# EAGLE design MYO power distribution pcb (EAGLE 6.1)
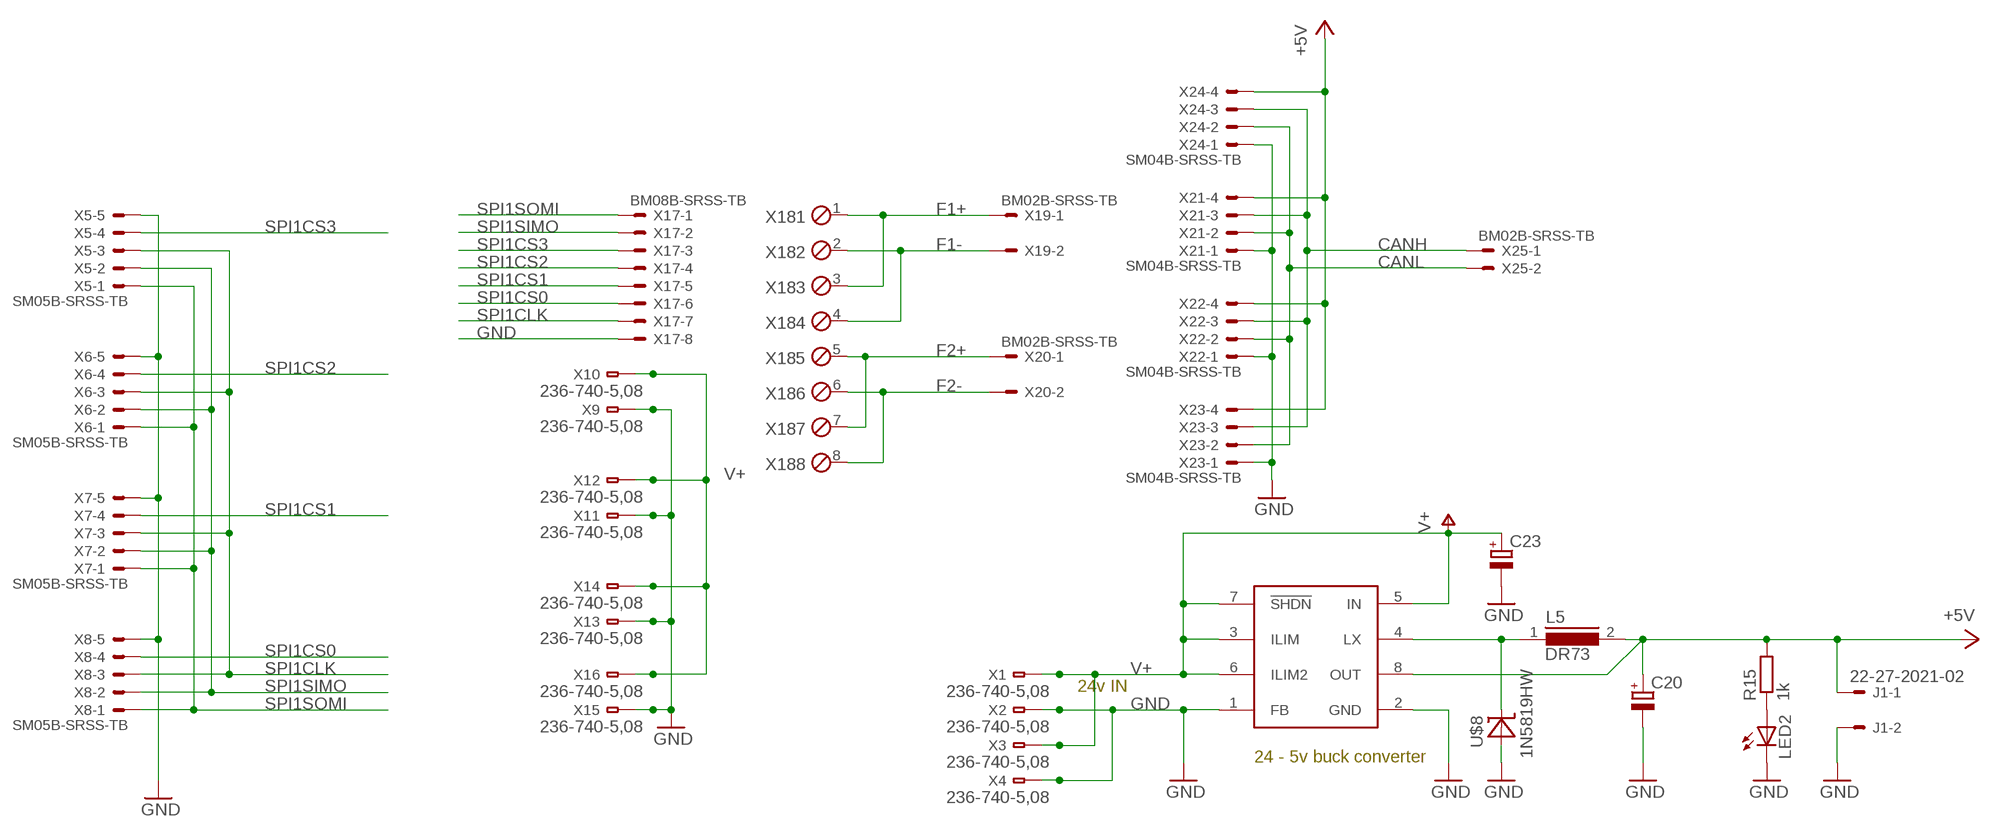
[diagram p0: schematic, sheet 1]

## Parts
C20  CPOL-EUC/6032-28R  [C/6032-28R]
C23  CPOL-EUC/6032-28R  [C/6032-28R]
J1  22-27-2021-02  [6410-02]
L5  DR73  [DR73]
LED2  LEDCHIP-LED0805  [CHIP-LED0805]
R15  1k  R-EU_R0603  [R0603]
U$5  MAX1776  [UMAX8]
U$8  1N5819HW  [SOD123]
X1  236-740-5,08  [236-4XX]
X2  236-740-5,08  [236-4XX]
X3  236-740-5,08  [236-4XX]
X4  236-740-5,08  [236-4XX]
X5  SM05B-SRSS-TB  [SM05B-SRSS-TB]
X6  SM05B-SRSS-TB  [SM05B-SRSS-TB]
X7  SM05B-SRSS-TB  [SM05B-SRSS-TB]
X8  SM05B-SRSS-TB  [SM05B-SRSS-TB]
X9  236-740-5,08  [236-4XX]
X10  236-740-5,08  [236-4XX]
X11  236-740-5,08  [236-4XX]
X12  236-740-5,08  [236-4XX]
X13  236-740-5,08  [236-4XX]
X14  236-740-5,08  [236-4XX]
X15  236-740-5,08  [236-4XX]
X16  236-740-5,08  [236-4XX]
X17  BM08B-SRSS-TB  [BM08B-SRSS-TB]
X18  CON_PTSA_8  [PHOENIX_PSTA_8]
X19  BM02B-SRSS-TB  [BM02B-SRSS-TB]
X20  BM02B-SRSS-TB  [BM02B-SRSS-TB]
X21  SM04B-SRSS-TB  [SM04B-SRSS-TB]
X22  SM04B-SRSS-TB  [SM04B-SRSS-TB]
X23  SM04B-SRSS-TB  [SM04B-SRSS-TB]
X24  SM04B-SRSS-TB  [SM04B-SRSS-TB]
X25  BM02B-SRSS-TB  [BM02B-SRSS-TB]

## Nets
+5V: C20.+ J1.1 L5.2 R15.2 U$5.8(OUT) X21.4 X22.4 X23.4 X24.4
CANH: X21.3 X22.3 X23.3 X24.3 X25.1
CANL: X21.2 X22.2 X23.2 X24.2 X25.2
F1+: X18.1 X18.3 X19.1
F1-: X18.2 X18.4 X19.2
F2+: X18.5 X18.7 X20.1
F2-: X18.6 X18.8 X20.2
GND: C20.- C23.- J1.2 LED2.C U$5.1(FB) U$5.2(GND) U$8.A X2.1@1(A1) X2.1@2(B1) X4.1@1(A1) X4.1@2(B1) X5.5 X6.5 X7.5 X8.5 X9.1@1(A1) X9.1@2(B1) X11.1@1(A1) X11.1@2(B1) X13.1@1(A1) X13.1@2(B1) X15.1@1(A1) X15.1@2(B1) X17.8 X21.1 X22.1 X23.1 X24.1
N$9: LED2.A R15.1
N$30: L5.1 U$5.4(LX) U$8.C
SPI1CLK: X5.3 X6.3 X7.3 X8.3 X17.7
SPI1CS0: X8.4 X17.6
SPI1CS1: X7.4 X17.5
SPI1CS2: X6.4 X17.4
SPI1CS3: X5.4 X17.3
SPI1SIMO: X5.2 X6.2 X7.2 X8.2 X17.2
SPI1SOMI: X5.1 X6.1 X7.1 X8.1 X17.1
V+: C23.+ U$5.3(ILIM) U$5.5(IN) U$5.6(ILIM2) U$5.7(!SHDN) X1.1@1(A1) X1.1@2(B1) X3.1@1(A1) X3.1@2(B1) X10.1@1(A1) X10.1@2(B1) X12.1@1(A1) X12.1@2(B1) X14.1@1(A1) X14.1@2(B1) X16.1@1(A1) X16.1@2(B1)

## Notes on the sheet
- 24v IN
- 24 - 5v buck converter

## Library data of the parts
C20 C23 = rcl:CPOL-EU: POLARIZED CAPACITOR, European symbol
J1 = con-molex:22-?-02: CONNECTOR wire to board 2.54 mm (.1 inch) pitch header; OC_FARNELL: unknown; OC_NEWARK: unknown
L5 = inductors:DR73: High Power Density, High Efficiency, Shielded Inductors Source: coiltronics_dr_series.pdf
LED2 = led:LED: LED OSRAM: - CHIPLED LG R971, LG N971, LY N971, LG Q971, LY Q971, LO R971, LY R971 LH N974, LH R974 LS Q976, LO Q976, LY Q976 LO Q996 - Hyper CHIPLED LW Q18S LB Q993, LB Q99A, LB R99A - SideLED LS A670, LO A670, LY A670, LG A670, LP A670 LB A673, LV A673, LT A673, LW A673 LH A674 LY A675 LS A676, LA A676, LO A676, LY A676, LW A676 LS A679, LY A679, LG A679 - Hyper Micro SIDELED® LS Y876, LA Y876, LO Y876, LY Y876 LT Y87S - SmartLED LW L88C, LW L88S LB L89C, LB L89S, LG L890 LS L89K, LO L89K, LY L89K LS L896, LA L896, LO L896, LY L896 - TOPLED LS T670, LO T670, LY T670, LG T670, LP T670 LSG T670, LSP T670, LSY T670, LOP T670, LYG T670 LG T671, LOG T671, LSG T671 LB T673, LV T673, LT T673, LW T673 LH T674 LS T676, LA T676, LO T676, LY T676, LB T676, LH T676, LSB T676, LW T676 LB T67C, LV T67C, LT T67C, LS T67K, LO T67K, LY T67K, LW E67C LS E67B, LA E67B, LO E67B, LY E67B, LB E67C, LV E67C, LT E67C LW T67C LS T679, LY T679, LG T679 LS T770, LO T770, LY T770, LG T770, LP T770 LB T773, LV T773, LT T773, LW T773 LH T774 LS E675, LA E675, LY E675, LS T675 LS T776, LA T776, LO T776, LY T776, LB T776 LHGB T686 LT T68C, LB T68C - Hyper Mini TOPLED® LB M676 - Mini TOPLED Santana® LG M470 LS M47K, LO M47K, LY M47K Source: http://www.osram.convergy.de LUXEON: - LUMILED® LXK2-PW12-R00, LXK2-PW12-S00, LXK2-PW14-U00, LXK2-PW14-V00 LXK2-PM12-R00, LXK2-PM12-S00, LXK2-PM14-U00 LXK2-PE12-Q00, LXK2-PE12-R00, LXK2-PE12-S00, LXK2-PE14-T00, LXK2-PE14-U00 LXK2-PB12-K00, LXK2-PB12-L00, LXK2-PB12-M00, LXK2-PB14-N00, LXK2-PB14-P00, LXK2-PB14-Q00 LXK2-PR12-L00, LXK2-PR12-M00, LXK2-PR14-Q00, LXK2-PR14-R00 LXK2-PD12-Q00, LXK2-PD12-R00, LXK2-PD12-S00 LXK2-PH12-R00, LXK2-PH12-S00 LXK2-PL12-P00, LXK2-PL12-Q00, LXK2-PL12-R00 Source: www.luxeon.com KINGBRIGHT: KA-3528ASYC Source: www.kingbright.com
R15 = rcl:R-EU_: RESISTOR, European symbol
U$5 = maxim:MAX1776: Step down Switching DC DC converter
U$8 = diode:1N5819HW
X1-X4 X9-X16 = con-wago:236: Anreihbare Einzelklemme 2,5 mm² 16A Rastermaß 5/5,08 | 7,5/7,62 | 10/10,16
X5-X8 = con-jst2:?M05B-SRSS-TB: Disconnectable Crimp style connector, 1.0mm pitch 5 contacts
X17 = con-jst2:?M08B-SRSS-TB: Disconnectable Crimp style connector, 1.0mm pitch 8 contacts
X18 = jas new (2):CON_PTSA_8
X19 X20 X25 = con-jst2:?M02B-SRSS-TB: Disconnectable Crimp style connector, 1.0mm pitch 2 contacts
X21-X24 = con-jst2:?M04B-SRSS-TB: Disconnectable Crimp style connector, 1.0mm pitch 4 contacts

## Board
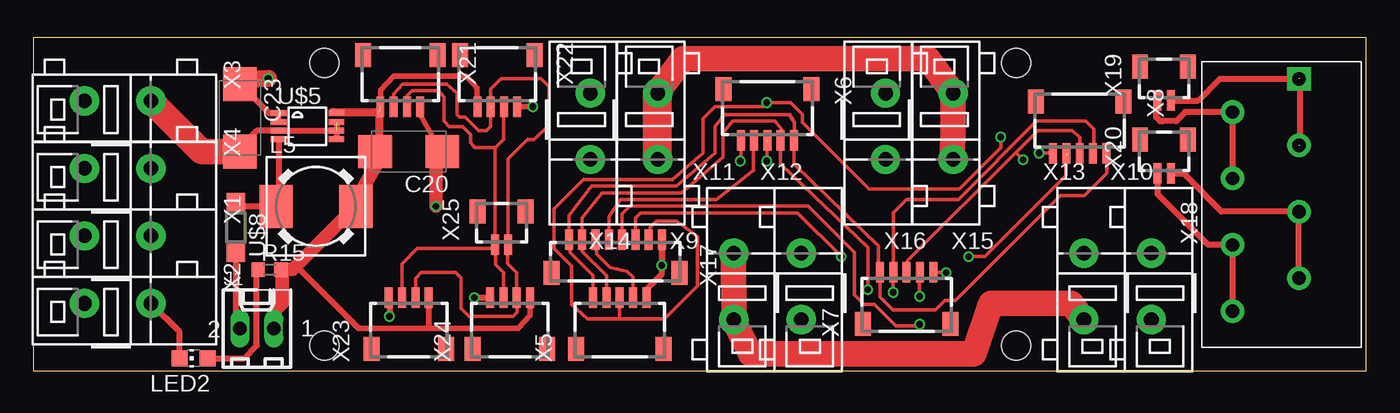
[diagram p1: board, top side]
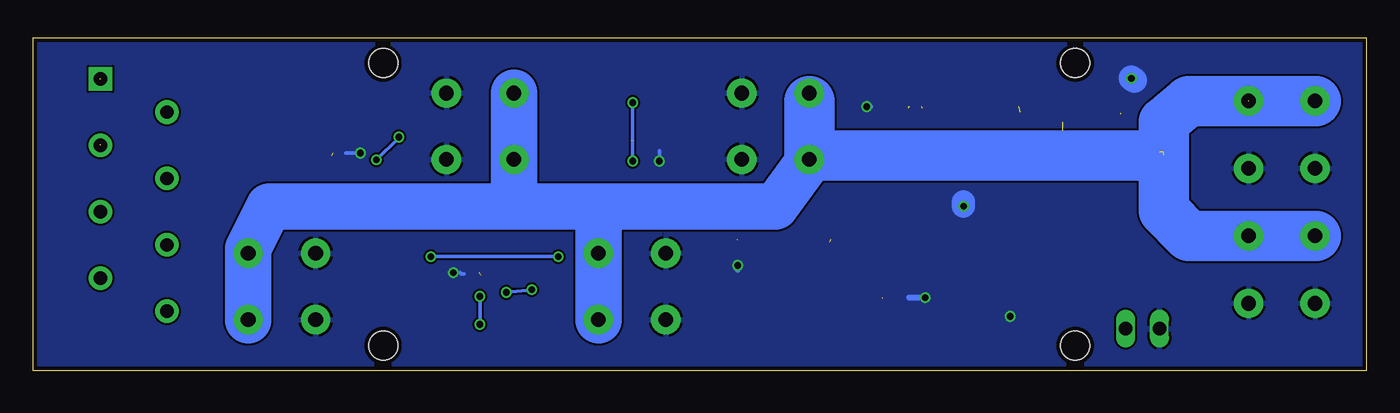
[diagram p2: board, bottom side, seen from below]

Size 100.31 x 25.07 mm. Coordinates in mm from the lower left corner, seen from the top.
Outline: 0,0 100.31,0 100.31,25.07 0,25.07 0,0
Copper layers (1*16): Top 0.035mm / dielectric 1.5mm / Bottom 0.035mm
Design rules: minimum track width 0.15mm, minimum drill 0.3mm, track to track 0.15mm, track to pad 0.15mm, pad to pad 0.15mm, via to via 0.15mm, smd to smd 0.15mm, copper to edge 0.3mm, drill to drill 0.2mm, minimum pad ring 0.2mm, minimum via ring 0.15mm, stop-mask expansion 0.075mm, vias tented up to drill 0mil, thermal gap 0.2mm
Holes 2.2 mm at 21.91,23.18 73.98,23.18 21.91,1.91 73.98,1.91

### Footprints (pad centres in the part's own frame; a part is rotated, then mirrored left to right if it is on the bottom)
C/6032-28R = smd 2.55 x 2.5: + 2.525,0; - -2.525,0
6410-02 = drill 1.016 long: 1 1.27,0; 2 -1.27,0
DR73 = smd 2.5 x 3.25: 1 -3,0; 2 3,0
CHIP-LED0805 = smd 1.2 x 1.2: A 0,-1.05; C 0,1.05
R0603 = smd 1 x 1.1: 1 -0.85,0; 2 0.85,0
UMAX8 = smd 0.45 x 1.2: 1 -0.975,-2.175; 2 -0.325,-2.175; 3 0.325,-2.175; 4 0.975,-2.175; 5 0.975,2.175; 6 0.325,2.175; 7 -0.325,2.175; 8 -0.975,2.175
SOD123 = smd 1.4 x 1.4: A 1.9,0; C -1.9,0
236-4XX = drill 1.1 pad 2.2: 1@1 0,-2.5; 1@2 0,2.5
SM05B-SRSS-TB = smd 0.6 x 1.55: 1 -2,2.975; 2 -1,2.975; 3 0,2.975; 4 1,2.975; 5 2,2.975 | smd 1.2 x 1.8: FIT@1 -3.3,-0.9; FIT@2 3.3,-0.9
BM08B-SRSS-TB = smd 0.6 x 1.55: 1 3.5,-1.625; 2 2.5,-1.625; 3 1.5,-1.625; 4 0.5,-1.625; 5 -0.5,-1.625; 6 -1.5,-1.625; 7 -2.5,-1.625; 8 -3.5,-1.625 | smd 1.2 x 1.8: FIT@1 4.8,0.9; FIT@2 -4.8,0.9
PHOENIX_PSTA_8 = drill 1 pad 1.778 square: 1 15,0 | drill 1 pad 1.778: 2 12.5,5; 3 10,0; 4 7.5,5; 5 5,0; 6 2.5,5; 7 0,0; 8 -2.5,5
BM02B-SRSS-TB = smd 0.6 x 1.55: 1 0.5,-1.625; 2 -0.5,-1.625 | smd 1.2 x 1.8: FIT@1 1.8,0.9; FIT@2 -1.8,0.9
SM04B-SRSS-TB = smd 0.6 x 1.55: 1 -1.5,2.975; 2 -0.5,2.975; 3 0.5,2.975; 4 1.5,2.975 | smd 1.2 x 1.8: FIT@1 -2.8,-0.9; FIT@2 2.8,-0.9

### Placement (x,y rotation side)
C20  28.26,16.51 180 top
C23  15.56,19.05 270 top
J1  16.83,3.17 0 top
L5  21.27,12.38 0 top
LED2  12.06,0.95 90 top
R15  17.78,7.62 0 top
U$5  20.64,18.41 270 top
U$8  15.24,10.79 270 top
X1  6.35,10.16 270 top
X2  6.35,5.08 270 top
X3  6.35,20.32 270 top
X4  6.35,15.24 270 top
X5  44.13,2.54 0 top
X6  55.24,20.32 180 top
X7  65.72,4.45 0 top
X8  78.74,19.37 180 top
X9  46.99,18.41 180 top
X10  84.14,6.35 0 top
X11  52.7,6.35 0 top
X12  57.78,6.35 0 top
X13  79.06,6.35 0 top
X14  41.91,18.41 180 top
X15  69.22,18.41 180 top
X16  64.14,18.41 180 top
X17  43.81,8.26 180 top
X18  95.25,6.99 90 top
X19  85.09,21.99 0 top
X20  85.09,16.51 0 top
X21  27.62,22.86 180 top
X22  34.92,22.86 180 top
X23  28.26,2.54 0 top
X24  35.88,2.54 0 top
X25  35.24,11.11 0 top

### Tracks (layer width: path | path; a pad name or v marks a point on that pad's centre or on a via)
+5V  (2 unrouted)
  Top 0.406: X24.4 37.38,4.18 36.5,3.2 29.8,3.2 | 29.8,3.2 29.8,3.6 29.8,5.47 X23.4 29.76,3.46 29.8,3.2 | 29.8,3.2 24.5,3.2 19.8,7.91 | X21.4 26.12,21.12 27.1,22.2 32.6,22.2 33.4,21.3 33.4,19.8
  Top 0.45: U$5.8 22.52,19.5 | 26.01,19.49 26.04,19.37 | 26.04,16.83 26.04,15.88
  Top 0.61: 22.52,19.5 22.6,19.5 26.01,19.49 | 26.04,19.37 26.04,16.83
  Top 1.016: J1.1 18.1,4.45 18.73,5.08 18.73,7.52 R15.2 19.51,7.62 19.8,7.91 L5.2 24.27,12.84 26.04,15.88 26.02,16.19 C20.+
CANH  (2 unrouted)
  Top 0.254: X21.3 27.12,20.82 27.8,21.6 31.1,21.6 31.9,20.9 31.9,19.3 32.1,19.1 32.5,19.1 33.5,18.1 34.1,18.1 34.4,18.4 34.4,19.7 | X24.3 36.38,7.42 35.7,8.1 35.7,9.45 X25.1 35.74,15.94 37.2,17.4 37.7,17.4 38.8,18.5 38.8,21.4 38.2,22 35.2,22 34.4,21.2 34.4,19.91 X22.3 | X23.3 28.76,6.96 29.2,7.4 31.8,7.4 32.2,7 32.2,4.7 32.8,4.1 36.1,4.1 36.4,4.4 36.4,5.5 36.3,5.6
  Top 0.45: 34.4,19.7 34.5,19.8
CANL
  Top 0.254: X24.2 35.38,7.42 34.8,8 34.8,9.2 | 34.8,9.2 34.8,9.43 | X21.2 28.12,20.72 28.5,21.1 30.5,21.1 30.9,20.6 30.9,18.8 31.3,18.4 32.3,18.4 32.9,17.8 32.9,17.2 33.2,16.8 34.8,16.8 | 34.8,16.8 35.4,17.4 35.4,19.86 | X23.2 27.76,8.06 28.9,9.2 34.8,9.2 | X25.2 34.74,16.74 34.8,16.8
  Top 0.45: 34.8,9.43 X25.2 | 35.4,19.86 X22.2
F1+  (2 unrouted)
  Top 0.45: X19.1 87.67,20.36 89.3,22 95.3,22 95.3,17
F1-
  Top 0.45: X18.4 X18.2 86.69,19.48 86,18.8 85,18.8 84.8,18.8 84.5,19.1 84.5,20.27 X19.2
F2+
  Top 0.406: 95.27,12 X18.5
  Top 0.45: X18.7 X18.5 89.42,11.98 86.6,14.8 85.67,14.8 X20.1
F2-
  Top 0.45: X20.2 84.59,13.31 88.4,9.5 90.23,9.5 X18.6 X18.8
GND  (via drill 0.5)  (2 unrouted)
  Top 0.254: X8.5 v75.71,16.39 v75.7,16.4 | X6.5 53.24,15.85 v53.2,15.8 | X7.5 68.68,7.42 v68.7,7.4
  Top 0.406: X21.1 29.12,19.28 30.3,17.2 30.2,16.89 C20.- | X22.1 37.59,19.89 v37.6,19.9
  Top 0.45: U$8.A 15.24,3.49 J1.2 | LED2.C 11.02,2.92 X2.1@2 | U$5.2 18.46,19.32 18.41,19.37 | U$5.1 17.76,19.39 16.51,20.64 16.51,21.26 16.19,21.57 | X5.5 46.13,6.13 47.31,7.3 v47.31,7.94 | v47.31,7.94 47.31,9.84 v47.31,7.94 | X23.1 26.8,5.47 v26.8,4.1 | X24.1 34.4,5.49 v33.2,5.5
  Top 1.016: 30.3,17.2 v30.3,12.4
  Top 1.27: C23.- 16.19,21.57 16.23,21.98 v17.68,22.02
  Top 1.93: X11.1@2 52.74,3.77 53.98,1.27 59.69,1.27 62.23,1.27 70.8,1.27 72.07,5.08 78.11,5.08 79.06,3.81 | X15.1@2 69.17,15.91 69.22,18.41 69.22,20.95 67.31,23.5 62.87,23.5 60.96,23.5 60.33,23.5 59.69,23.5 48.9,23.5 46.99,20.95
  Top 2.184: X9.1@2 46.99,18.6 46.99,20.95
  Bottom 0.254: v75.7,16.4 76.8,16.4 | v53.2,15.8 53.2,16.6 | v68.7,7.4 68.2,7.4 68.1,7.3 68,7.3 67.9,7.3
  Bottom 0.406: v37.6,19.9 37.3,19.9
  Bottom 0.45: v47.31,7.94 47.31,7.62 | v26.8,4.1 26.8,4.2 | v33.2,5.5 34.3,5.5 34.4,5.5
  Bottom 1.778: v30.3,12.4 30.3,12.7
  Bottom 1.93: v17.68,22.02 17.46,21.91
  pour Bottom: 0,25.4 100.33,25.4 100.33,0 0,0
N$9
  Top 0.45: LED2.A 15.88,0.95 16.83,1.91 16.83,7.52 R15.1
N$30
  Top 0.45: U$5.4 18.46,12.57 L5.1 15.55,12.38 U$8.C
SPI1CLK  (via drill 0.5)  (1 unrouted)
  Top 0.254: X5.3 44.13,4.55 | 44.13,4.55 44.13,4.43 | 44.13,4.43 44.13,4.37 44.1,3.9 | 44.1,3.9 47.5,3.9 50,6.4 50,10.1 48.4,11.3 46.9,11.3 46.4,10.8 46.4,9.96 X17.7 | X8.3 78.74,17.56 78.2,18.1 75.6,18.1 73.95,16.45 | 73.95,16.45 65.8,8.3 65.8,7.5 X7.3 | 44.13,4.55 44.13,4.43 | 44.13,4.43 44.1,3.9 | 44.1,3.9 41.7,3.9 40.5,5 40.5,7.9 39.2,9.2 39.2,12.2 41.4,14.4 48.1,14.4 50.4,16.4 50.4,19 51.1,19.7 51.3,19.9 54.9,19.9 v55.2,20.2 57,20.2 57.9,19.3 57.9,18.7 62.9,13.7 69.7,13.7 72.8,16.8 v72.8,17.6 | v55.2,15.8 55.2,17.3 | v74.5,15.9 74.4,16 73.95,16.45
  Bottom 0.254: v55.2,20.2 v55.2,15.8 | v72.8,17.6 72.8,17.5 v74.5,15.9
SPI1CS0  (via drill 0.5)  (1 unrouted)
  Top 0.254: X17.6 45.31,11.52 45.7,11.9 57.5,11.9 v60.8,8.6 | v70.4,8.6 71.6,8.6 77.7,14.7 77.7,16.1 77.8,16.2 | 77.8,16.2 77.8,16.1 77.8,16.2
  Bottom 0.254: v60.8,8.6 v70.4,8.6
SPI1CS1  (via drill 0.5)  (1 unrouted)
  Top 0.254: X17.5 44.31,11.81 44.9,12.4 58.3,12.4 59.5,11.2 61.8,8.9 61.8,5.7 62.5,5 63.3,5 64.3,4 64.9,3.4 66.6,3.4 v66.7,3.5 | v66.7,5.6 66.7,7.1 66.6,7.2
  Bottom 0.254: v66.7,3.5 v66.7,5.6
SPI1CS2
  Top 0.254: X17.4 43.31,11.62 44.2,12.9 51.4,12.9 54.1,15 54.2,15.1 54.2,17.3 X6.4
SPI1CS3
  Top 0.254: X5.4 45.13,7.07 44.7,7.5 43.4,7.8 42.4,8.8 42.4,9.79 X17.3
SPI1SIMO  (via drill 0.5)
  Top 0.254: X5.2 43.13,7.17 41.3,9 41.3,9.87 X17.2 41.31,11.52 42.8,13.4 48.8,13.4 51.9,16.1 51.9,17.9 52.6,18.8 55.8,18.8 56.3,18.2 56.3,17.4 X6.2 56.24,15.55 62.8,9.3 v62.8,6.1 | v64.7,5.9 64.7,7.4 X7.2 64.72,11.92 65.7,12.9 69.6,12.9 75.5,18.8 79.2,18.8 79.8,18.2 79.8,16.45 X8.2
  Bottom 0.254: v62.8,6.1 v64.7,5.9
SPI1SOMI  (1 unrouted)
  Top 0.254: X5.1 42.13,7.17 40.4,8.9 40.4,9.7 | X17.1 40.31,11.71 42,13.9 48.4,13.9 51.3,16.4 51.3,18.4 52,19.3 56.9,19.3 57.3,18.7 57.3,17.4 X6.1 57.24,15.55 63.6,9.4 63.6,7.3 X7.1 63.72,5.58 64.7,4.6 67.9,4.6 68.6,5.3 69.4,5.3 77.3,13.2 79.1,13.2 80.8,14.9 80.8,16.33 X8.1
V+  (4 unrouted)
  Top 0.45: 15.24,16.51 16.82,18.09 U$5.3 U$5.6 | U$5.7 U$5.5
  Top 1.93: C23.+ 12.69,16.52 8.89,20.32
  Bottom 0.15: X1.1@1 3.9,10.2 3.9,10.16 | X16.1@1 64.1,20.9 X16.1@1 | X3.1@1 3.9,20.3 3.9,20.32 | X14.1@2 42,15.9 41.91,16.51 | X12.1@1 57.8,3.9 57.78,3.9 | X14.1@1 42,20.9 41.91,20.32 | X10.1@1 83.84,3.58 84.14,4.22
  Bottom 2.54: 41.91,16.51 41.91,16.19 X14.1@2 41.91,15.88 | 84.14,9.21 X10.1@2 84.14,4.22 X10.1@1 84.14,3.81 | X16.1@2 X16.1@1 64.14,20.95 | X12.1@2 57.78,3.9 X12.1@1 57.78,3.81
  Bottom 3.5: 41.91,20.32 41.91,16.51 | 41.91,15.88 44.45,12.38 57.78,12.38 | 57.78,12.38 64.14,12.38 | 64.14,12.38 82.55,12.38 84.14,9.21 X10.1@2 84.14,4.22 X10.1@1 84.14,3.81 | 64.14,20.95 X16.1@1 X16.1@2 64.14,12.38 | 57.78,3.81 X12.1@1 57.78,3.9 X12.1@2 57.78,12.38
  Bottom 3.81: 15.24,16.19 41.91,16.19 41.91,16.51 41.91,20.32 | 3.81,20.32 X3.1@1 3.9,20.32 X3.1@2 13.34,20.32 15.24,18.73 15.24,12.06 13.34,10.16 X1.1@2 3.9,10.16 X1.1@1 3.81,10.16